# EAGLE design senseair_breakout (EAGLE 9.6.2)
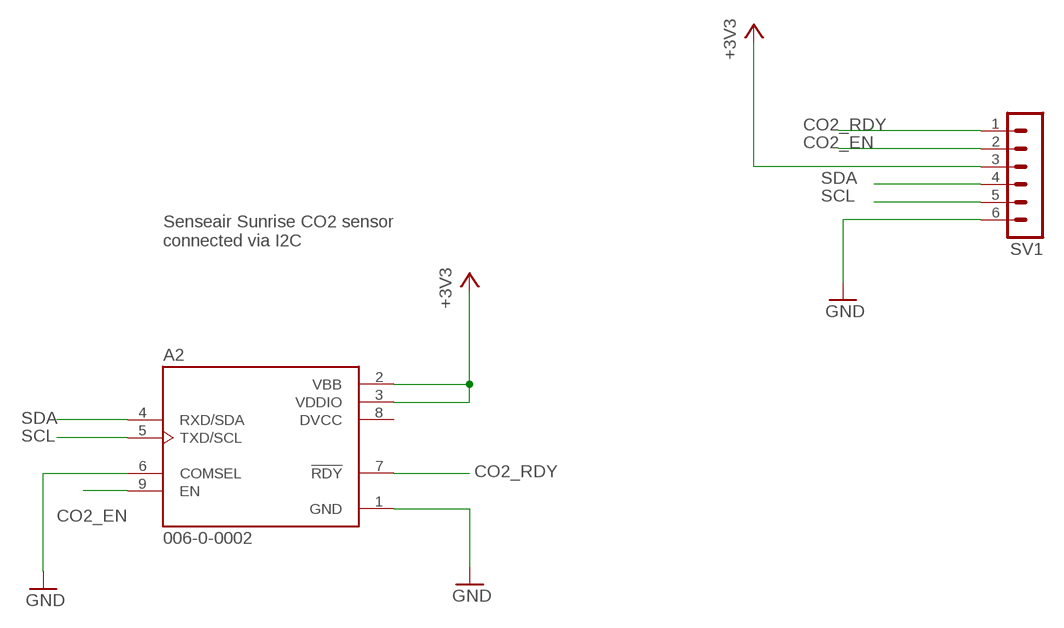
[diagram p0: schematic, sheet 1]

## Parts
A2  006-0-0002  [XDCR_006-0-0002]
SV1  MA06-1  [MA06-1]

## Nets
+3V3: A2.2(VBB) A2.3(VDDIO) SV1.3
CO2_EN: A2.9(EN) SV1.2
CO2_RDY: A2.7(!RDY!) SV1.1
GND: A2.1(GND) A2.6(COMSEL) SV1.6
SCL: A2.5(TXD/SCL) SV1.5
SDA: A2.4(RXD/SDA) SV1.4

## Notes on the sheet
- Senseair Sunrise CO2 sensor
  connected via I2C

## Power pins joined to a net without a drawn wire
DVCC: A2.8(DVCC)

## Library data of the parts
A2 = Senseair_Sunrise:006-0-0002: Check availability <https://pricing.snapeda.com/parts/006-0-0002/Senseair%20North%20America%20Inc./view-part?ref=eda>; AVAILABILITY: Not in stock; CHECK_PRICES: https://www.snapeda.com/parts/006-0-0002/Senseair+North+America+Inc./view-part/?ref=eda; DESCRIPTION: Carbon Dioxide (CO2) Sensor -; MF: Senseair North America Inc.; MP: 006-0-0002; PACKAGE: None; PRICE: None; SNAPEDA_LINK: https://www.snapeda.com/parts/006-0-0002/Senseair+North+America+Inc./view-part/?ref=snap
SV1 = con-lstb:MA06-1: PIN HEADER; OC_FARNELL: unknown; OC_NEWARK: unknown

## Board
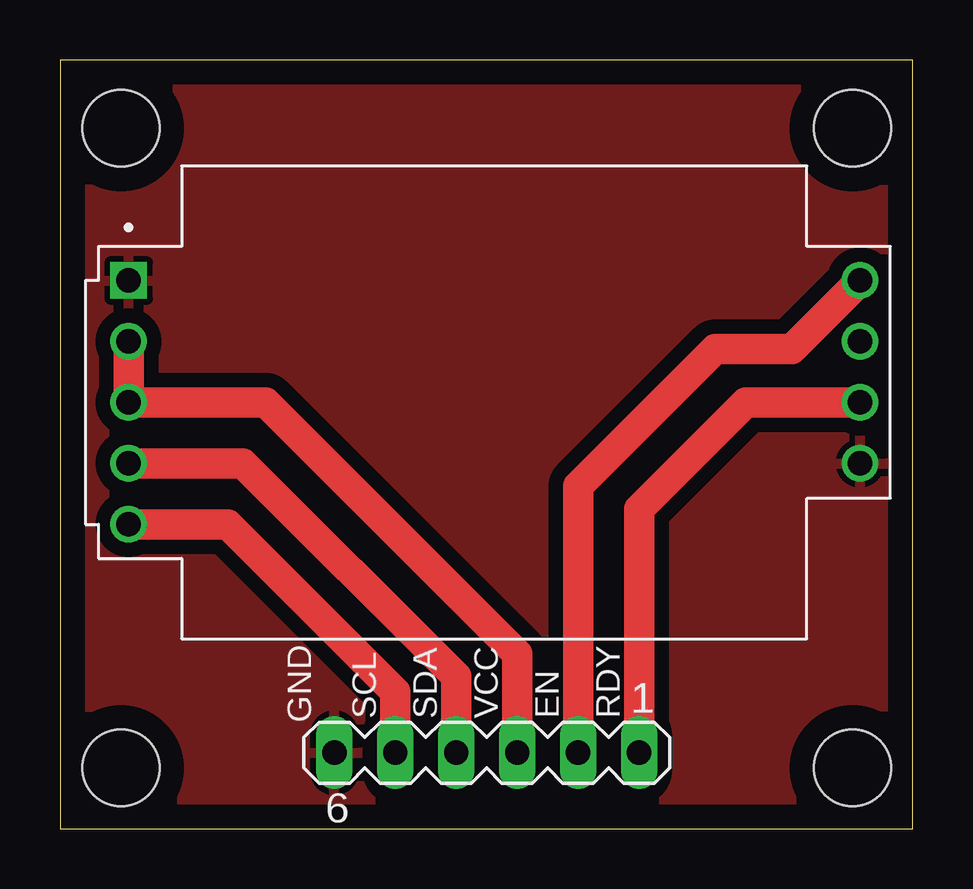
[diagram p1: board, top side]
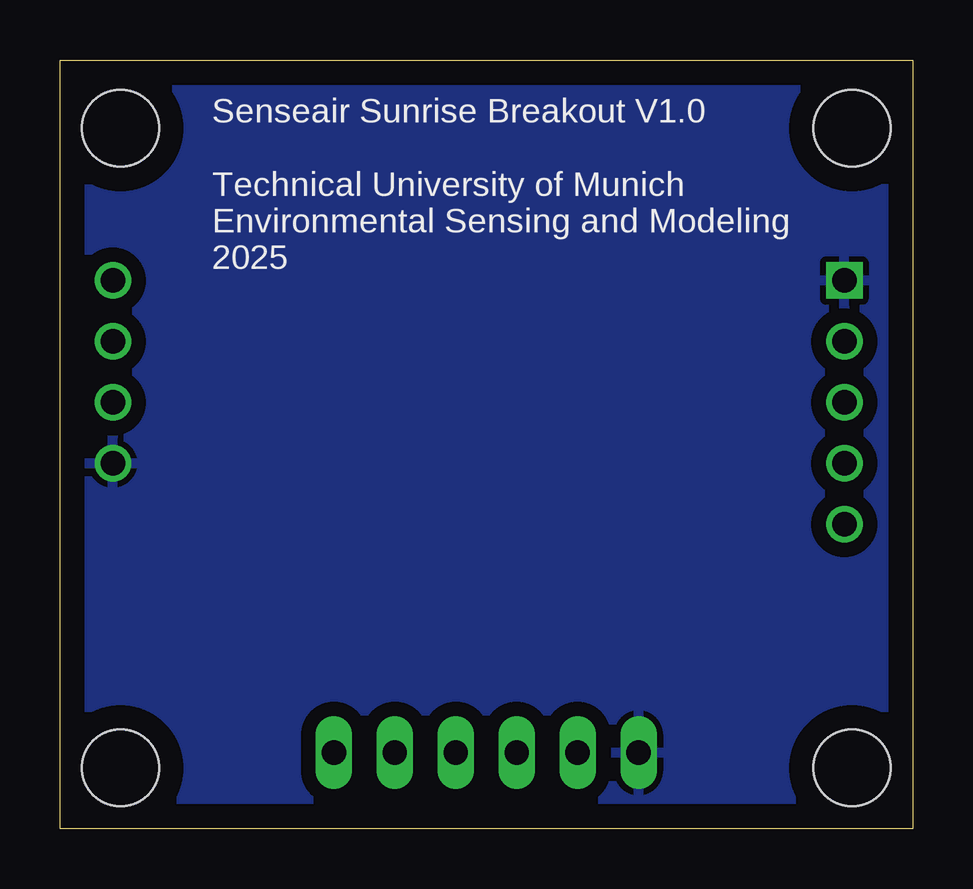
[diagram p2: board, bottom side, seen from below]

Size 35.54 x 32.05 mm. Coordinates in mm from the lower left corner, seen from the top.
Outline: 0,0 35.54,0 35.54,32.05 0,32.05 0,0
Copper layers (1*16): Top 0.035mm / dielectric 1.5mm / Bottom 0.035mm
Design rules "default": minimum track width 6mil, minimum drill 0.35mm, track to track 6mil, track to pad 6mil, pad to pad 6mil, via to via 6mil, smd to smd 6mil, copper to edge 40mil, drill to drill 6mil, minimum pad ring 10mil, minimum via ring 8mil, stop-mask expansion 4mil, vias tented up to drill 0mil, thermal gap 10mil
Holes 3.2 mm at 33.02,29.21 2.54,29.21 2.54,2.54 33.02,2.54

### Footprints (pad centres in the part's own frame; a part is rotated, then mirrored left to right if it is on the bottom)
XDCR_006-0-0002 = drill 1.016 square: 1 -15.24,5.08 | drill 1.016: 2 -15.24,2.54; 3 -15.24,0; 4 -15.24,-2.54; 5 -15.24,-5.08; 6 15.24,-2.54; 7 15.24,0; 8 15.24,2.54; 9 15.24,5.08
MA06-1 = drill 1.016 long: 1 -6.35,0; 2 -3.81,0; 3 -1.27,0; 4 1.27,0; 5 3.81,0; 6 6.35,0

### Placement (x,y rotation side)
A2  18.1,17.78 0 top
SV1  17.78,3.17 180 top

### Tracks (layer width: path | path; a pad name or v marks a point on that pad's centre or on a via)
+3V3
  Top 1.27: A2.2 A2.3 8.57,17.78 19.05,7.3 SV1.3
CO2_EN
  Top 1.27: A2.9 30.48,20 27.3,20 21.59,14.29 SV1.2
CO2_RDY
  Top 1.27: A2.7 28.57,17.78 24.13,13.34 SV1.1
GND
  pour Top (isolate 0.61): 0.32,31.75 0.32,0.32 35.24,0.32 35.24,31.75
  pour Bottom (isolate 0.61): 0.32,31.75 0.32,0.32 35.24,0.32 35.24,31.75
SCL
  Top 1.27: A2.5 6.99,12.7 13.97,5.71 SV1.5
SDA
  Top 1.27: A2.4 7.62,15.24 16.51,6.35 SV1.4

### Text on the board
tNames: SCL | SDA | VCC | EN | RDY | GND
bNames: Senseair Sunrise Breakout V1.0 / / Technical University of Munich / Environmental Sensing and Modeling / 2025